# EAGLE design MorseAttiny (EAGLE 8.1.0)
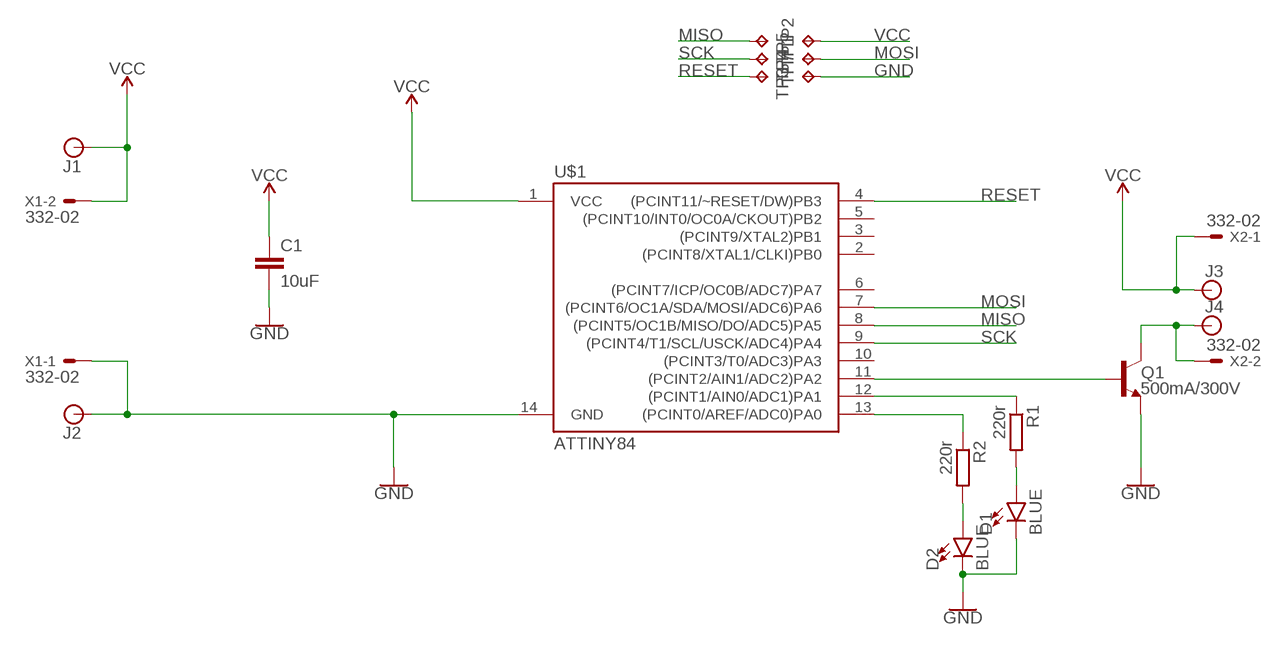
[diagram p0: schematic, sheet 1]

## Parts
C1  10uF  10UF-1210-50V-20%  [1210]
D1  BLUE  LED-BLUE1206  [LED-1206]
D2  BLUE  LED-BLUE1206  [LED-1206]
J1  BANANA_CONN  [BANANA_CONN]
J2  BANANA_CONN  [BANANA_CONN]
J3  BANANA_CONN  [BANANA_CONN]
J4  BANANA_CONN  [BANANA_CONN]
Q1  500mA/300V  TRANS_NPN-MMBTA42  [SOT23-3]
R1  220r  R-EU_M0805  [M0805]
R2  220r  R-EU_M0805  [M0805]
TP1  TPTP18R  [TP18R]
TP2  TPTP18R  [TP18R]
TP3  TPTP18R  [TP18R]
TP4  TPTP18R  [TP18R]
TP5  TPTP18R  [TP18R]
TP7  TPTP18R  [TP18R]
U$1  ATTINY84  [SO14]
X1  332-02  [332-02]
X2  332-02  [332-02]

## Nets
GND: C1.2 D1.C D2.C J2.P$1 Q1.2(E) TP7.TP U$1.14(GND) X1.1
MISO: TP5.TP U$1.8((PCINT5/OC1B/MISO/DO/ADC5)PA5)
MOSI: TP1.TP U$1.7((PCINT6/OC1A/SDA/MOSI/ADC6)PA6)
N$1: R2.1 U$1.13((PCINT0/AREF/ADC0)PA0)
N$2: D2.A R2.2
N$3: D1.A R1.2
N$4: R1.1 U$1.12((PCINT1/AIN0/ADC1)PA1)
N$5: Q1.1(B) U$1.11((PCINT2/AIN1/ADC2)PA2)
RESET: TP3.TP U$1.4((PCINT11/~RESET/DW)PB3)
SCK: TP4.TP U$1.9((PCINT4/T1/SCL/USCK/ADC4)PA4)
SPK: J4.P$1 Q1.3(C) X2.2
VCC: C1.1 J1.P$1 J3.P$1 TP2.TP U$1.1(VCC) X1.2 X2.1
Unconnected: U$1.2((PCINT8/XTAL1/CLKI)PB0) U$1.3((PCINT9/XTAL2)PB1) U$1.5((PCINT10/INT0/OC0A/CKOUT)PB2) U$1.6((PCINT7/ICP/OC0B/ADC7)PA7) U$1.10((PCINT3/T0/ADC3)PA3)

## Library data of the parts
C1 = SparkFun-Capacitors:10UF: 10.0µF ceramic capacitors A capacitor is a passive two-terminal electrical component used to store electrical energy temporarily in an electric field.; PROD_ID: CAP-09824
D1 D2 = SparkFun-LED:LED-BLUE: Blue SMD LED Used in manufacturing of various products at SparkFun Packages: 0603 - SMD 0603 package [Product Link] <http://www.digikey.com/product-detail/en/SMLE12BC7TT86/511-1589-2-ND/1641808> 1206 - SMD1206 package [Product Link] <http://www.digikey.com/product-detail/en/lite-on-inc/LTST-C150TBKT/160-1643-1-ND/573584> SparkFun Products: ESP8266 Thing-Dev Board <https://www.sparkfun.com/products/13711> RedBoard <https://www.sparkfun.com/products/12757>; PROD_ID: DIO-09911
J1-J4 = SparkFun-Connectors:BANANA_CONN: Through-hole Banana Jack Basic PTH connection for banana jack plugs SparkFun Products: Multimeter Kit <https://www.sparkfun.com/products/retired/10956> Banana to Alligator Cable <https://www.sparkfun.com/products/retired/509> Banana to Alligator Coax Cable <https://www.sparkfun.com/products/retired/508> Banana to Banana Cable <https://www.sparkfun.com/products/retired/507> Banana to IC Hook Cables <https://www.sparkfun.com/products/retired/506>
Q1 = SparkFun-DiscreteSemi:TRANS_NPN: NPN transistor Current controlled devices typically used to amplify current or used as a switch. BC547 - COM-08928 <http://www.sparkfun.com/products/8928> (TO-92 45V 100mA) (1.Collector 2.Base 3.Emitter) 2N3904 - COM-00521 <http://www.sparkfun.com/products/521> (TO-92 40V 200mA) (1.Emitter 2.Base 3.Collector) P2N2222A - COM-12852 <http://www.sparkfun.com/products/12852> (TO-92 40V 600mA) (1.Collector 2.Base 3.Emitter); PROD_ID: TRANS-09116
R1 R2 = rcl:R-EU_: RESISTOR, European symbol
TP1-TP5 TP7 = testpad:TP: Test pad
U$1 = SparkFun-IC-Microcontroller:ATTINY84: Atmel 14-pin 2/4/8kB flash uC Datasheet <https://cdn.sparkfun.com/datasheets/Widgets/doc8006.pdf> SparkFun Products Tiny AVR Programmer <https://www.sparkfun.com/products/11801> (PGM-11801) SparkFun Servo Trigger - Continuous Rotation <https://www.sparkfun.com/products/13872> (WIG-13872) SparkFun Servo Trigger <https://www.sparkfun.com/products/13118> (WIG-13118); PROD_ID: IC-11285
X1 X2 = con-garry:332-02: 2 Pin - 2mm Dual Row Source: www.mpe-connector.de / garry_shortform_2012.pdf

## Board
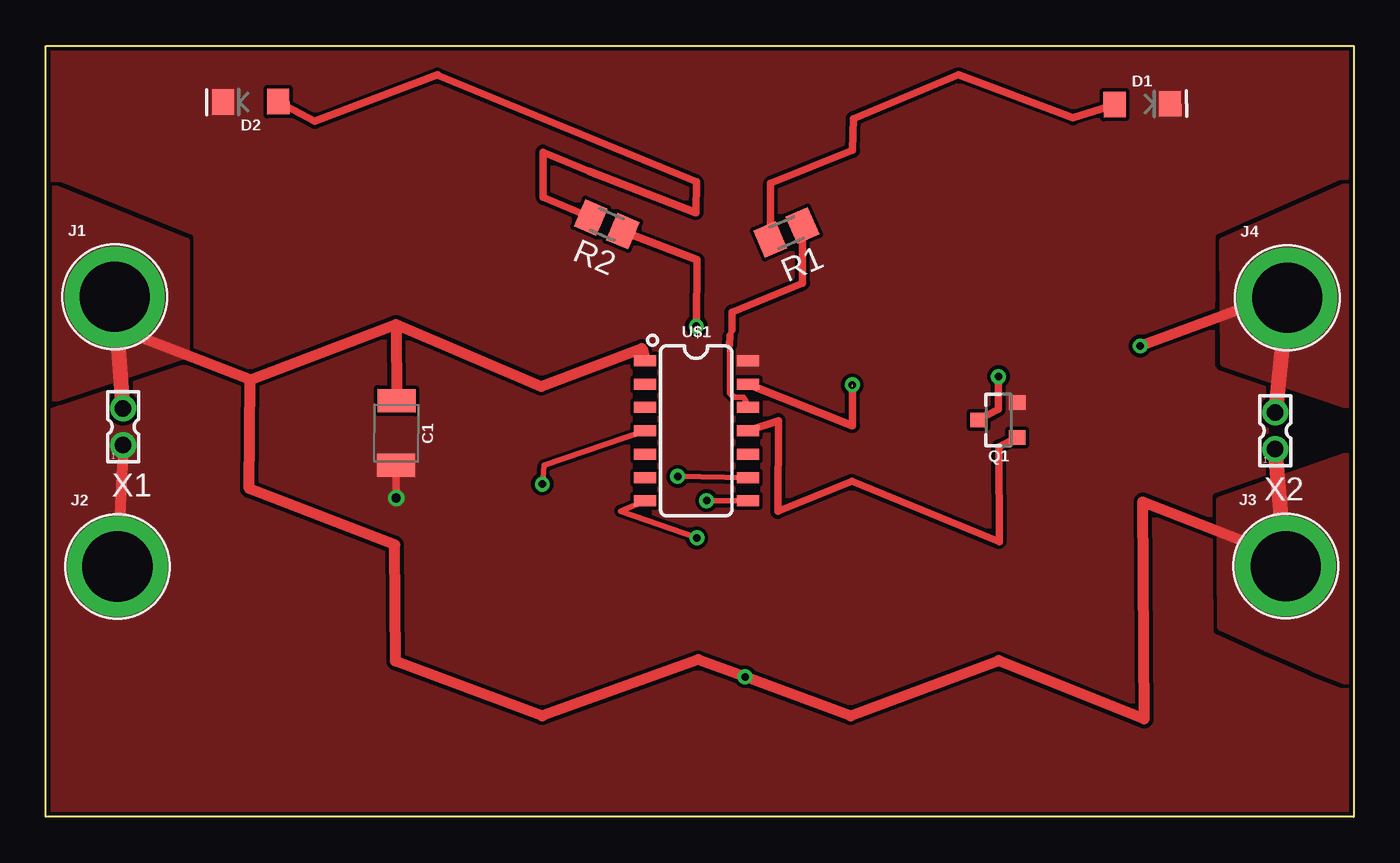
[diagram p1: board, top side]
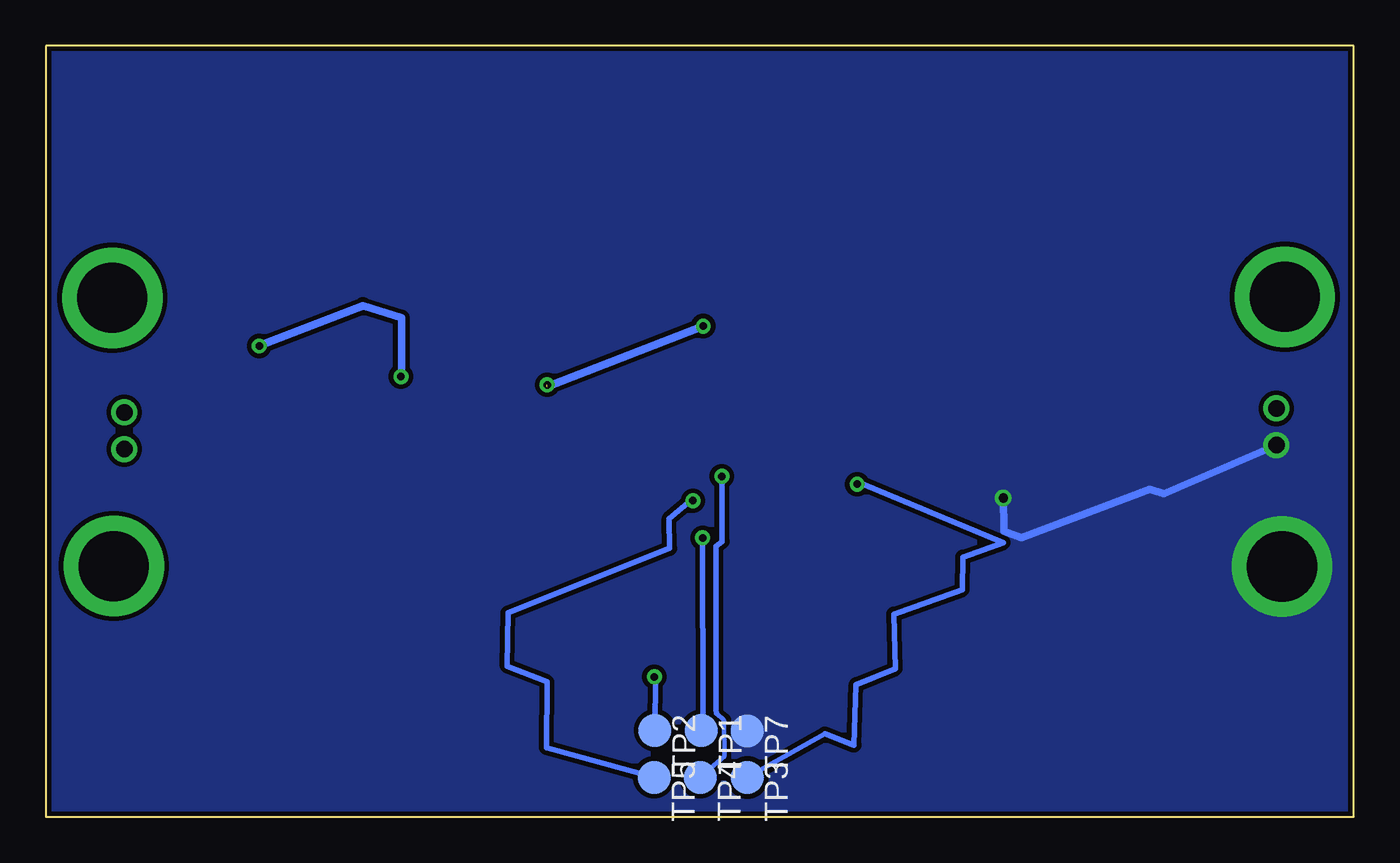
[diagram p2: board, bottom side, seen from below]

Size 71.12 x 41.91 mm. Coordinates in mm from the lower left corner, seen from the top.
Outline: 0,0 0,41.91 71.12,41.91 71.12,0 0,0
Copper layers (1*16): Top 0.035mm / dielectric 1.5mm / Bottom 0.035mm
Design rules "default *": minimum track width 10mil, minimum drill 12mil, track to track 8mil, track to pad 8mil, pad to pad 8mil, via to via 8mil, smd to smd 8mil, copper to edge 8mil, drill to drill 8mil, minimum pad ring 10mil, minimum via ring 8mil, stop-mask expansion 4mil, vias tented up to drill 0mil, thermal gap 10mil

### Footprints (pad centres in the part's own frame; a part is rotated, then mirrored left to right if it is on the bottom)
1210 = smd 1.27 x 2.06: 1 -1.755,0; 2 1.755,0
LED-1206 = smd 1.2 x 1.4: A -1.5,0; C 1.5,0
BANANA_CONN = drill 3.81 pad 5.461: P$1 0,0
SOT23-3 = smd 0.8 x 0.9: 1 -0.95,-1; 2 0.95,-1; 3 0,1.1
M0805 = smd 1.3 x 1.6: 1 -0.95,0; 2 0.95,0
TP18R = smd 1.8 x 1.8: TP 0,0
SO14 = smd 0.6 x 1.2: 1 -3.175,-2.8; 2 -1.905,-2.8; 3 -0.635,-2.8; 4 0.635,-2.8; 5 1.905,-2.8; 6 3.175,-2.8; 7 4.445,-2.8; 8 4.445,2.8; 9 3.175,2.8; 10 1.905,2.8; 11 0.635,2.8; 12 -0.635,2.8; 13 -1.905,2.8; 14 -3.175,2.8
332-02 = drill 0.9 pad 1.27: 1 0,-1; 2 0,1

### Placement (x,y rotation side)
C1  19.06,20.86 269.5 top
D1  59.63,38.75 0.8 top
D2  11.14,38.87 180.6 top
J1  3.74,28.27 0 top
J2  3.89,13.61 0 top
J3  67.43,13.63 0 top
J4  67.51,28.22 0 top
Q1  51.82,21.58 90 top
R1  40.27,31.77 203.2 top
R2  30.5,32.21 156.7 top
TP1  35.49,4.69 270 bottom
TP2  38,4.7 270 bottom
TP3  32.97,2.14 270 bottom
TP4  35.54,2.14 270 bottom
TP5  38.04,2.14 270 bottom
TP7  32.97,4.65 270 bottom
U$1  35.38,21.62 270 top
X1  4.2,21.2 0 top
X2  66.86,20.99 0 top

### Tracks (layer width: path | path; a pad name or v marks a point on that pad's centre or on a via)
GND  (via drill 0.5)
  Top 0.406: v19.05,17.34 C1.2
  Top 0.61: X1.1 J2.P$1
  Bottom 0.406: X1.1 10.31,17.57 11.09,17.81 18.08,15.16 19.03,15.53 19.05,17.48 v19.05,17.34
  pour Bottom (isolate 0.254, no thermals): 0.09,41.91 0.05,-0.05 71.14,0.05 71.09,41.91 0.05,41.95
  pour Top (rank 4, no thermals): 0.15,41.93 0.19,34.66 7.86,31.68 7.91,24.66 0.24,21.99 0.29,20.04 0.24,0 71.07,0 71.12,6.73 63.47,9.9 63.42,17.55 71.07,20.18 71.12,21.89 63.37,24.33 63.42,31.64 71.12,34.96 71.07,41.83
MISO  (via drill 0.41)
  Top 0.305: v35.93,17.19 U$1.8
  Bottom 0.305: TP5.TP 43.9,3.75 43.87,7.33 46.03,8.2 45.99,11.09 37.19,14.59 37.23,16.21 36.04,17.22 v35.93,17.19
MOSI  (via drill 0.41)
  Top 0.305: v35.4,15.16 31.26,16.62 U$1.7
  Bottom 0.305: v35.4,15.16 35.37,5.33 TP1.TP
N$1  (via drill 0.41)  (1 unrouted)
  Top 0.305: 38.65,23.33 U$1.13
  Top 0.406: R2.1 35.41,30.29 v35.37,26.68 | U$1.13 43.87,21.27 v43.86,23.49
  Bottom 0.406: v35.37,26.68 43.87,23.39
N$2
  Top 0.406: D2.A 14.62,37.81 21.29,40.34 21.31,40.31 35.37,34.52 35.36,32.84 29.54,35.1 27.03,36.14 27.04,33.67 R2.2
N$3
  Top 0.406: R1.2 39.41,34.44 43.87,36.23 43.91,37.96 49.62,40.33 55.87,38.01 D1.A
N$4
  Top 0.305: U$1.12 38.03,22.7 38.02,22.71 37.94,22.82 37.41,22.82 37.17,23.06 37.19,25.67 | 37.21,26.15 37.31,26.47
  Top 0.406: 37.19,25.67 37.21,26.15 | 37.31,26.47 37.3,27.44 41.16,29.02 R1.1
N$5
  Top 0.406: U$1.11 39.83,21.54 39.81,16.6 43.85,18.24 51.85,14.96 51.83,20.13 Q1.1
RESET  (via drill 0.41)
  Top 0.305: v27,18.08 27.09,19.1 U$1.4
  Bottom 0.305: TP3.TP 28.75,4.51 27.16,3.9 27.06,7.18 24.93,8.05 25,11.01 21.28,12.35 21.25,14.12 19.05,14.91 27.06,18.23 v27,18.08
SCK  (via drill 0.41)
  Top 0.305: v34.36,18.51 U$1.9
  Bottom 0.254: TP4.TP 34.22,3.28 34.23,5.25 34.66,5.63
  Bottom 0.305: 34.66,5.63 34.68,5.79 34.68,14.7 34.34,14.96 34.36,14.96 v34.36,18.51
SPK  (via drill 0.41, 0.41 pad 0.41)
  Top 0.406: Q1.3 51.8,22.15 v51.81,23.94
  Top 0.61: v59.52,25.6 66.53,28.21 J4.P$1
  Top 0.813: J4.P$1 X2.2
  Bottom 0.305: v51.81,23.94 51.78,24.39
  Bottom 0.406: v59.52,25.6 53.87,27.8 51.78,27.12 51.78,24.39
  pour Top (no thermals): 71.44,34.6 64.01,31.31 64.05,24.65 71.74,22.05 71.88,34.76 71.68,34.7
VCC  (via drill 0.41)
  Top 0.305: 19,8.47 18.95,8.49
  Top 0.406: 19.04,26.77 C1.1 | J1.P$1 4.2,26.42
  Top 0.61: 19.04,26.77 C1.1 | U$1.1 32.42,25.47 26.94,23.4 19.04,26.77 11.1,23.76 | 11.1,23.76 11.06,17.85 18.98,14.79 19,8.47 27,5.49 35.48,8.55 v38.03,7.61 43.77,5.49 51.81,8.49 59.73,5.3 59.65,17.12 66.78,14.36 J3.P$1 | 11.1,23.76 4.2,26.42
  Top 0.813: X1.2 J1.P$1 | J3.P$1 X2.1
  Bottom 0.305: TP2.TP 37.97,7.61 v38.03,7.61
  pour Top (isolate 0.305, no thermals): -0.25,34.48 7.62,31.28 7.62,25.11 -0.12,22.55 -0.24,33.03
  pour Top (no thermals): 71.23,19.78 63.85,17.22 63.89,10.32 arc5 71.52,7.07 71.75,19.95

### Text on the board
201bmp: -.. .. --. .. - .- .-.. | - | + | - | + | .. -.. . .- - .. --- -.